# Altium schematic sheet Digital Port K.SchDoc: Port K Digital Control
size A4
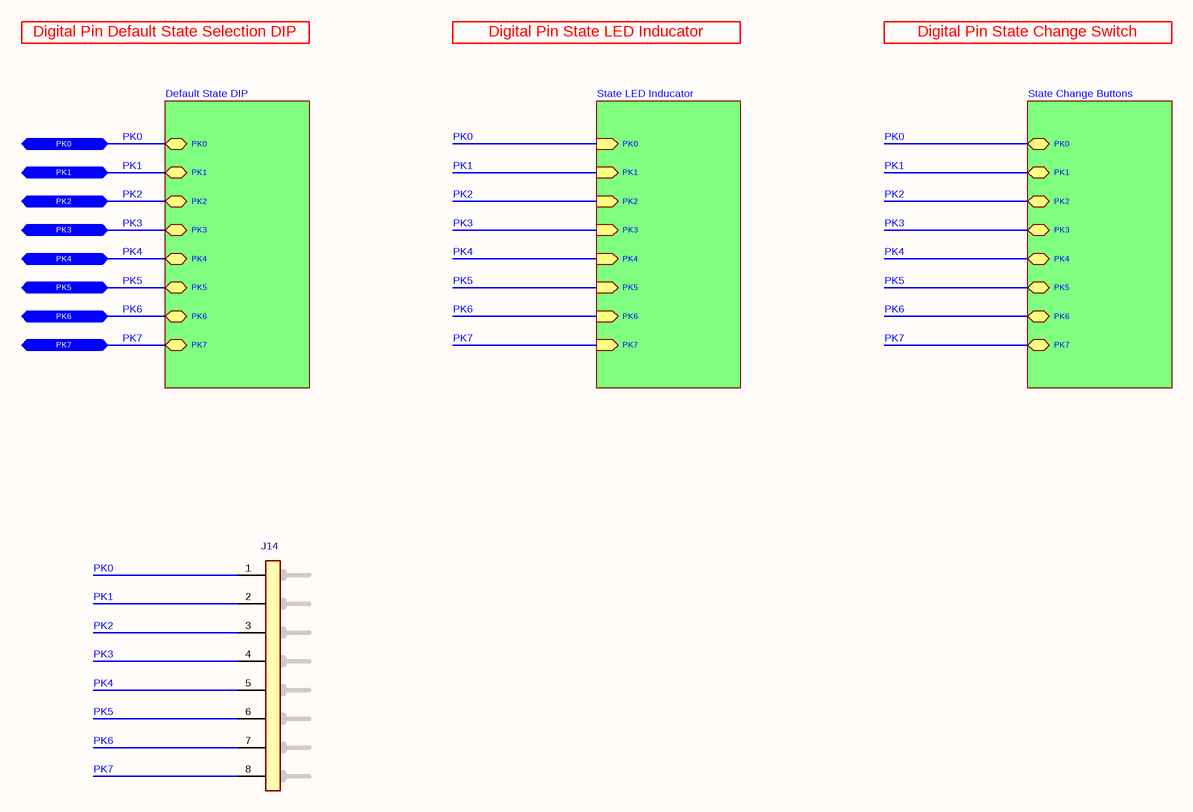
[diagram p0: Digital Port K.SchDoc]

## Parts
J14  2.54 mm Pitch 8P Male Connector  [8P Header]  (value not drawn)

## Sub-sheets
Default State DIP = Digital Port K Default State DIP.SchDoc: PK1 (bidir), PK0 (bidir), PK7 (bidir), PK4 (bidir), PK6 (bidir), PK3 (bidir), PK5 (bidir), PK2 (bidir)
State Change Buttons = Digital Port K Button.SchDoc: PK1 (bidir), PK0 (bidir), PK7 (bidir), PK4 (bidir), PK6 (bidir), PK3 (bidir), PK5 (bidir), PK2 (bidir)
State LED Inducator = Digital Port K State LED Inducator.SchDoc: PK1 (in), PK0 (in), PK7 (in), PK4 (in), PK6 (in), PK3 (in), PK5 (in), PK2 (in)

## Ports
PK0 (bidir), PK1 (bidir), PK2 (bidir), PK3 (bidir), PK4 (bidir), PK5 (bidir), PK6 (bidir), PK7 (bidir)

## Nets
PK0: J14.1(Pin-1) ; port PK0, sheet Default State DIP/PK0, sheet State LED Inducator/PK0, sheet State Change Buttons/PK0
PK1: J14.2(Pin-2) ; port PK1, sheet Default State DIP/PK1, sheet State LED Inducator/PK1, sheet State Change Buttons/PK1
PK2: J14.3(Pin-3) ; port PK2, sheet Default State DIP/PK2, sheet State LED Inducator/PK2, sheet State Change Buttons/PK2
PK3: J14.4(Pin-4) ; port PK3, sheet Default State DIP/PK3, sheet State LED Inducator/PK3, sheet State Change Buttons/PK3
PK4: J14.5(Pin-5) ; port PK4, sheet Default State DIP/PK4, sheet State LED Inducator/PK4, sheet State Change Buttons/PK4
PK5: J14.6(Pin-6) ; port PK5, sheet Default State DIP/PK5, sheet State LED Inducator/PK5, sheet State Change Buttons/PK5
PK6: J14.7(Pin-7) ; port PK6, sheet Default State DIP/PK6, sheet State LED Inducator/PK6, sheet State Change Buttons/PK6
PK7: J14.8(Pin-8) ; port PK7, sheet Default State DIP/PK7, sheet State LED Inducator/PK7, sheet State Change Buttons/PK7

## Notes on the sheet
- Digital Pin Default State Selection DIP
- Digital Pin State LED Inducator
- Digital Pin State Change Switch
- Title
- Size:
- Date:
- A4
- Number:
- Time:
- Revision:
- Sheet
- of
- File:

## Library data of the parts
J14 = Connector - Male Header 8P (2.54): Headers & Wire Housings BREAKAWAY HDR VERT 8; Manufacturer Name: Molex; Position: 8; Row: 1; Pitch: 2.54 mm; Manufacturer Part Number: 22-28-4083; Mouser Part Number: 538-22-28-4083; ROHS: Yes; ComponentLink1Description: DataSheet; ComponentLink1URL: https://www.mouser.com.tr/datasheet/2/276/0022284063_PCB_HEADERS-228265.pdf; ComponentLink2Description: Mouser; ComponentLink2URL: https://www.mouser.com.tr/ProductDetail/Molex/22-28-4083/?qs=%2Fha2pyFaduguMWEp6M%252Bj0x6fHxUvnRGD%252BIxBoa6MO5w%3D